# EAGLE design sensor (EAGLE 6.5.0)
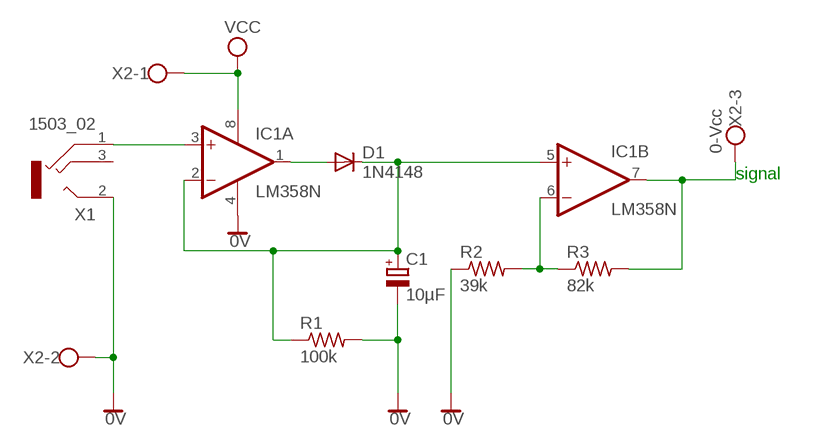
[diagram p0: schematic, sheet 1]

## Parts
C1  10µF  CPOL-EUE2,5-6E  [E2,5-6E]
D1  1N4148  1N4148DO35-10  [DO35-10]
IC1  LM358N  [DIL08]
R1  100k  R-US_0207/10  [0207/10]
R2  39k  R-US_0207/10  [0207/10]
R3  82k  R-US_0207/10  [0207/10]
X1  1503_02  [1503_02]
X2  0-Vcc  W237-103  [W237-103]

## Nets
0V: C1.- IC1.4(P:V-) R1.2 R2.1 X1.2 X2.2
N$1: C1.+ D1.C IC1.2(A:-IN) IC1.5(B:+IN) R1.1
N$2: IC1.6(B:-IN) R2.2 R3.1
N$3: D1.A IC1.1(A:OUT)
N$5: IC1.7(B:OUT) R3.2 X2.3
N$8: IC1.3(A:+IN) X1.1
VCC: IC1.8(P:V+) X2.1
Unconnected: X1.2@2 X1.3

## Notes on the sheet
- signal

## Library data of the parts
C1 = rcl:CPOL-EU: POLARIZED CAPACITOR, European symbol
D1 = diode:1N4148: DIODE high speed (Philips)
IC1 = linear:LM358: OP AMP also LM158; LM258; LM2904 Source: http://cache.national.com/ds/LM/LM158.pdf
R1-R3 = rcl:R-US_: RESISTOR, American symbol
X1 = con-lumberg:1503_02: Jack connectors according to JISC 6560, 3.5 mm Klinkeneinbaukupplung nach JISC 6560, 3,5 mm, 3-polig/stereo, abgewinkelte Ausführung, Surface-Mount-Technik (SMT) Source: http://www.lumberg.com/Produkte/PDFs/1503_02.pdf; OC_FARNELL: 1216979; OC_NEWARK: unknown
X2 = con-wago-500:W237-103: WAGO SCREW CLAMP; MPN: 237-103; OC_FARNELL: unknown; OC_NEWARK: 18M7116

## Board
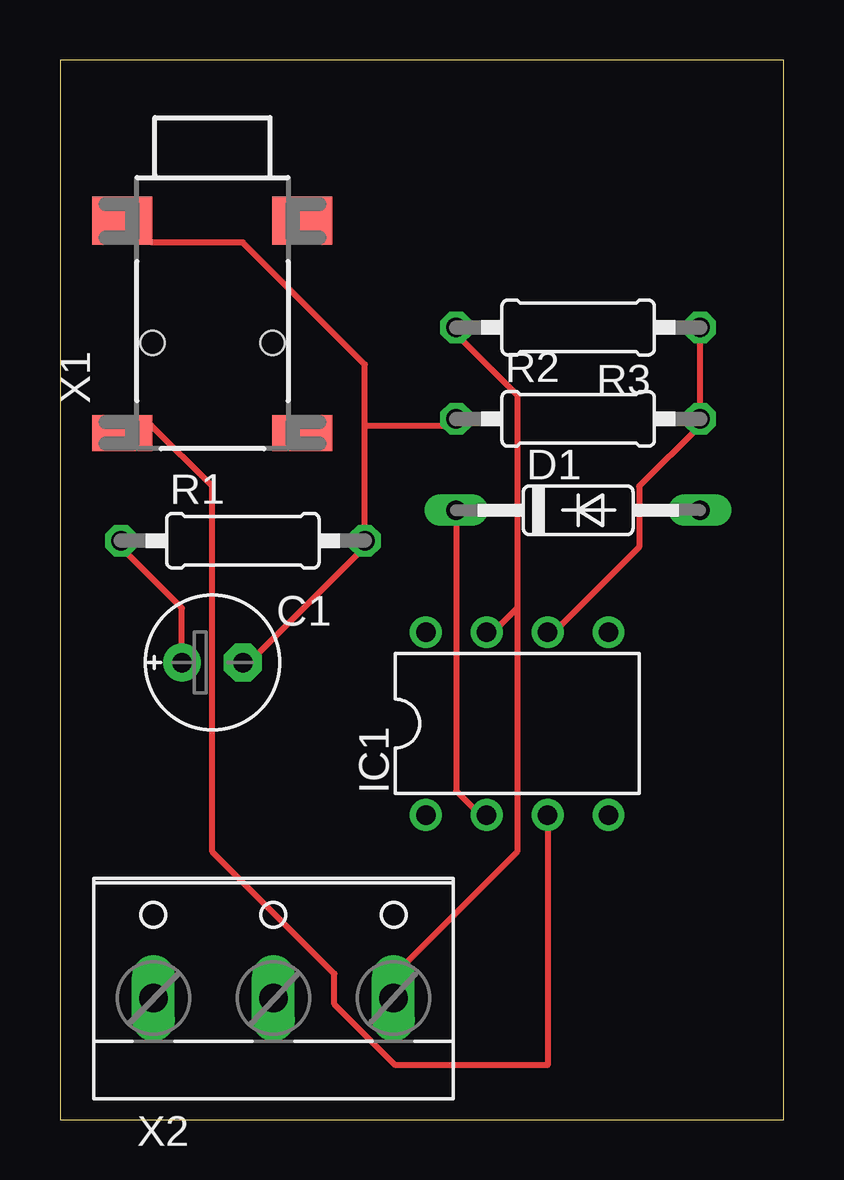
[diagram p1: board, top side]
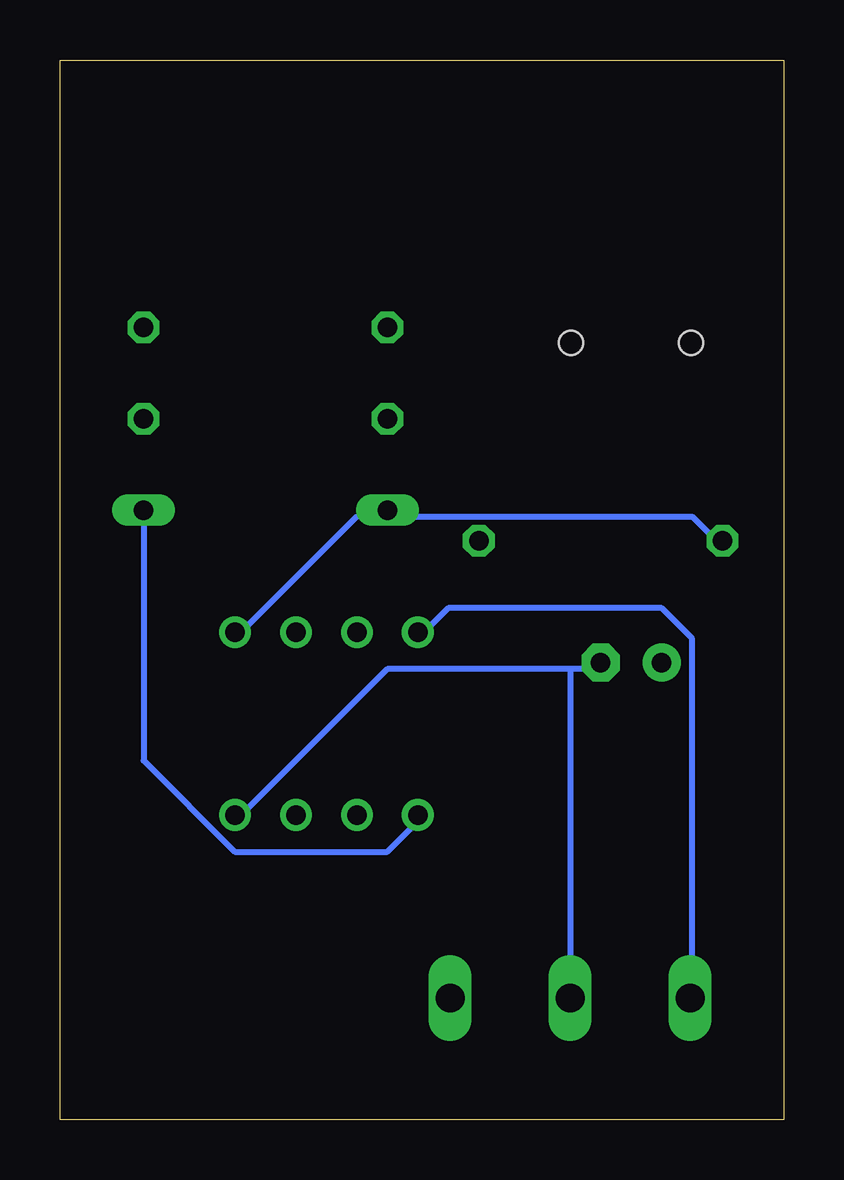
[diagram p2: board, bottom side, seen from below]

Size 30.15 x 44.17 mm. Coordinates in mm from the lower left corner, seen from the top.
Outline: 0,0 30.15,0 30.15,44.17 0,44.17 0,0
Copper layers (1*16): Top 0.035mm / dielectric 1.5mm / Bottom 0.035mm
Design rules "default": minimum track width 10mil, minimum drill 24mil, track to track 8mil, track to pad 8mil, pad to pad 8mil, via to via 8mil, smd to smd 8mil, copper to edge 40mil, drill to drill 8mil, minimum pad ring 10mil, minimum via ring 8mil, stop-mask expansion 4mil, vias tented up to drill 0mil, thermal gap 10mil

### Footprints (pad centres in the part's own frame; a part is rotated, then mirrored left to right if it is on the bottom)
E2,5-6E = drill 0.813 pad 1.575: + -1.27,0 | drill 0.813 pad 1.575 octagon: - 1.27,0
DO35-10 = drill 0.813 long: A 5.08,0; C -5.08,0
DIL08 = drill 0.813 pad 1.27: 1 -3.81,-3.81; 2 -1.27,-3.81; 3 1.27,-3.81; 4 3.81,-3.81; 5 3.81,3.81; 6 1.27,3.81; 7 -1.27,3.81; 8 -3.81,3.81
0207/10 = drill 0.813 octagon: 1 -5.08,0; 2 5.08,0
1503_02 = smd 2.5 x 1.5: 1 -3.75,-10.75; 3 3.75,-10.75 | smd 2.5 x 2: 2 -3.75,-1.9; 2@2 3.75,-1.9 | hole 1: -2.5,-7; 2.5,-7
W237-103 = drill 1.194 long: 1 -5,-1.29; 2 0,-1.29; 3 5,-1.29

### Placement (x,y rotation side)
C1  6.35,19.05 0 top
D1  21.59,25.4 0 top
IC1  19.05,16.51 0 top
R1  7.62,24.13 0 top
R2  21.59,29.21 0 top
R3  21.59,33.02 180 top
X1  6.35,39.37 0 top
X2  8.89,6.35 0 top

### Tracks (layer width: path | path; a pad name or v marks a point on that pad's centre or on a via)
0V
  Top 0.254: 12.7,28.94 R1.2 12.7,23.86 7.62,18.78 C1.- | 12.7,28.94 12.7,31.48 7.62,36.56 3.81,36.56 X1.2 | 12.7,28.94 16.51,28.94 R2.1
  Bottom 0.254: 8.89,18.78 7.62,18.78 C1.- | 8.89,18.78 16.51,18.78 22.86,12.43 IC1.4 | 8.89,18.78 X2.2
N$1
  Top 0.254: R1.1 2.54,23.86 5.08,21.32 C1.+ 5.08,18.78 | D1.C 16.51,13.7 17.78,12.43 IC1.2
  Bottom 0.254: 16.51,25.13 17.78,25.13 22.86,20.05 IC1.5 | 16.51,25.13 3.81,25.13 2.54,23.86 R1.1 | 16.51,25.13 D1.C
N$2
  Top 0.254: IC1.6 20.32,20.05 24.13,23.86 24.13,26.4 26.67,28.94 R2.2 R3.1
N$3
  Bottom 0.254: D1.A 26.67,14.97 22.86,11.16 16.51,11.16 15.24,12.43 IC1.1
N$5
  Top 0.254: 19.05,21.32 17.78,20.05 IC1.7 | 19.05,21.32 19.05,30.21 16.51,32.75 R3.2 | 19.05,21.32 19.05,11.16 13.97,6.08 X2.3
N$8
  Top 0.254: IC1.3 20.32,2.27 13.97,2.27 11.43,4.81 11.43,6.08 6.35,11.16 6.35,26.4 3.81,28.94 X1.1
VCC
  Bottom 0.254: IC1.8 15.24,20.05 13.97,21.32 5.08,21.32 3.81,20.05 3.81,6.08 X2.1